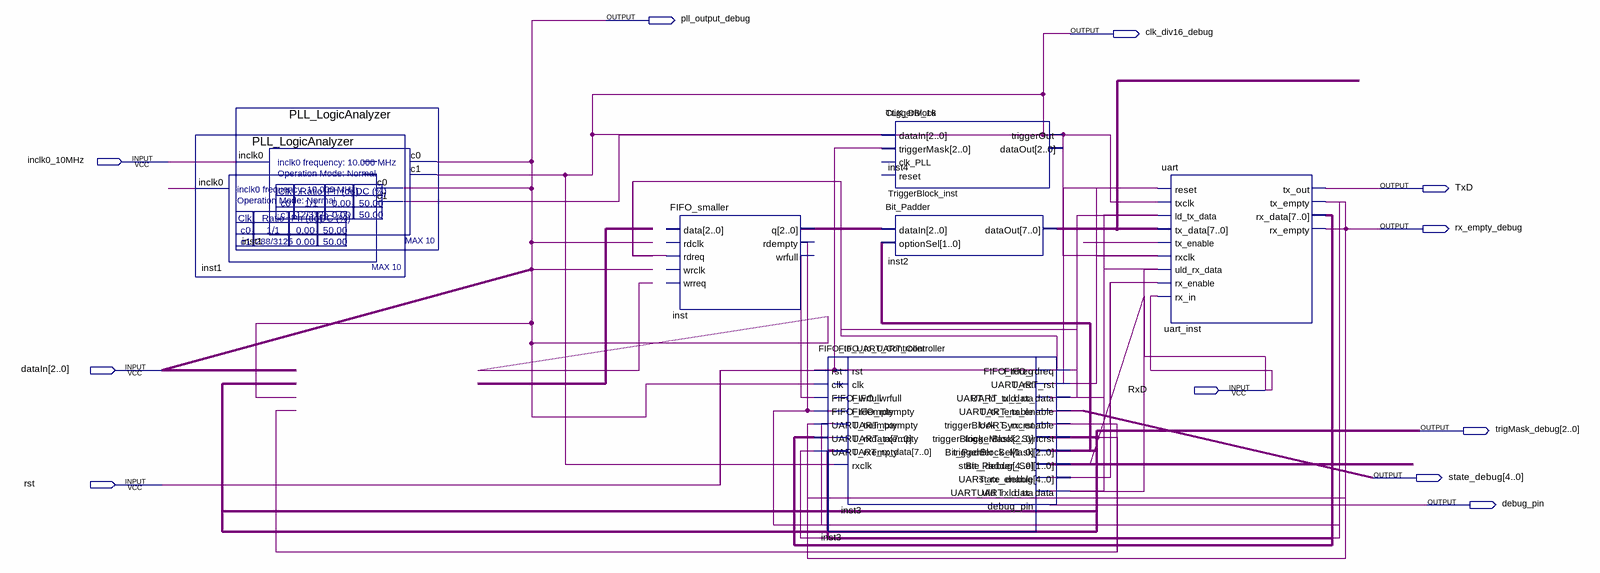
[diagram p0: schematic sheet]
// Quartus schematic LogicAnalyzer.bdf as structural Verilog: 8 symbols, 11 pins
module LogicAnalyzer (
  input  inclk0_10MHz,
  input  [2:0] dataIn,
  input  RxD,
  input  rst,
  output pll_output_debug,
  output clk_div16_debug,
  output TxD,
  output rx_empty_debug,
  output [2:0] trigMask_debug,
  output [4:0] state_debug,
  output debug_pin
);

  wire inst3_triggerblock_syncrst, inst3_uart_ld_tx_data, inst3_uart_rst, inst3_uart_rx_enable,
       inst3_uart_tx_enable, inst3_uart_uld_rx_data, undriven, undriven_2, undriven_3, undriven_4, undriven_5;
  wire [1:0] inst3_bit_padder_sel, inst3_bit_padder_sel_2;
  wire [2:0] inst_q;
  wire [4:0] inst3_state_debug;
  wire [7:0] inst2_dataout, uart_inst_rx_data;

  PLL_LogicAnalyzer inst1 (.inclk0(undriven), .triggerOut(pll_output_debug), .dataOut(clk_div16_debug));
  PLL_LogicAnalyzer inst1_dup2 (.inclk0(inclk0_10MHz), .c0(pll_output_debug), .c1(clk_div16_debug));
  FIFO_smaller inst (.rdreq(rst), .q(inst_q));  // open: data, rdclk, wrclk, wrreq, rdempty, wrfull
  FIFO_to_UART_Controller inst3 (
    .rst(rst), .clk(pll_output_debug), .FIFO_wrfull(undriven_5), .FIFO_rdempty(undriven_4),
    .UART_txempty(rx_empty_debug), .UART_rxdata(uart_inst_rx_data), .UART_rxempty(rx_empty_debug),
    .FIFO_rdreq(rst), .UART_rst(inst3_uart_rst), .UART_ld_tx_data(inst3_uart_ld_tx_data),
    .UART_tx_enable(inst3_uart_tx_enable), .triggerBlock_Syncrst(inst3_triggerblock_syncrst),
    .triggerBlock_Mask(trigMask_debug), .Bit_Padder_Sel(inst3_bit_padder_sel),
    .state_debug(inst3_state_debug), .UART_rx_enable(inst3_uart_rx_enable),
    .UART_uld_rx_data(inst3_uart_uld_rx_data), .debug_pin(debug_pin));
  FIFO_to_UART_Controller inst3_dup2 (
    .rst(rst), .FIFO_rdempty(undriven_3), .UART_txempty(rx_empty_debug), .UART_rxempty(rx_empty_debug),
    .UART_rx_data(uart_inst_rx_data), .rxclk(clk_div16_debug), .FIFO_rdreq(rst), .UART_rst(inst3_uart_rst),
    .UART_uld_rx_data(inst3_uart_ld_tx_data), .UART_tx_enable(inst3_uart_tx_enable),
    .UART_rx_enable(inst3_uart_rx_enable), .triggerBlock_Syncrst(inst3_triggerblock_syncrst),
    .triggerBlock_Mask(trigMask_debug), .Bit_Padder_Sel(inst3_bit_padder_sel_2),
    .state_debug(inst3_uart_rx_enable), .UART_ld_tx_data(inst3_uart_uld_rx_data));  // open: clk, FIFO_wrfull
  CLK_Div_16 inst4 (
    .dataIn({3{clk_div16_debug}}), .triggerMask({3{rst}}), .triggerOut(clk_div16_debug),
    .dataOut(clk_div16_debug));  // open: clk_PLL, reset
  Bit_Padder inst2 (.dataIn(inst_q), .optionSel(inst3_bit_padder_sel), .dataOut(inst2_dataout));
  uart uart_inst (
    .reset(inst3_uart_rst), .txclk(clk_div16_debug), .ld_tx_data(inst3_uart_ld_tx_data),
    .tx_data(inst2_dataout), .tx_enable(undriven_2), .rxclk(clk_div16_debug),
    .uld_rx_data(inst3_uart_uld_rx_data), .rx_enable(inst3_uart_rx_enable), .rx_in(RxD), .tx_out(TxD),
    .tx_empty(rx_empty_debug), .rx_data(uart_inst_rx_data), .rx_empty(rx_empty_debug));
endmodule
